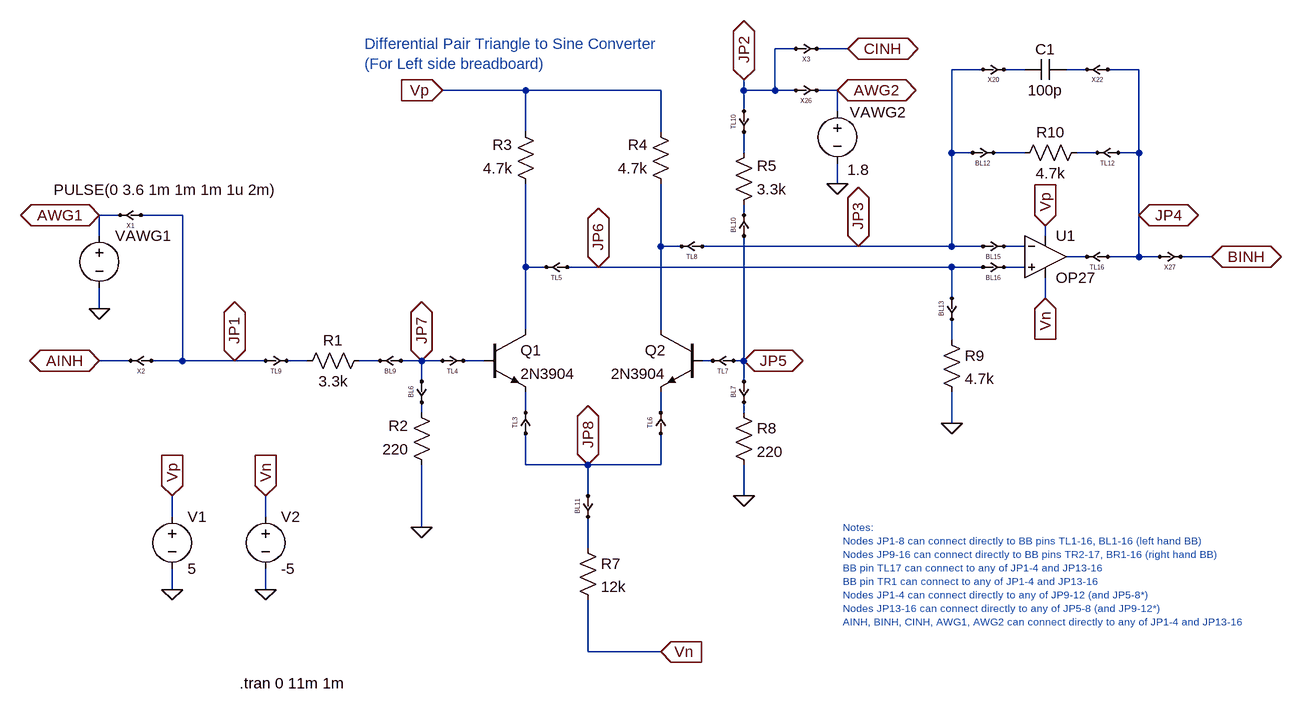
[diagram p0: schematic diffpair_triangle_to_sine.asc]
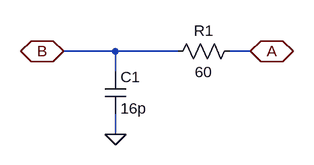
[diagram p1: sub-circuit cross_point.asc]
diffpair_triangle_to_sine.asc, the LTspice schematic file:
Version 4
SHEET 1 880 960
WIRE -16 -144 -48 -144
WIRE 64 -144 16 -144
WIRE 272 -112 224 -112
WIRE 336 -112 304 -112
WIRE 432 -112 400 -112
WIRE 512 -112 464 -112
WIRE -432 -80 -560 -80
WIRE -224 -80 -432 -80
WIRE -96 -80 -96 -96
WIRE -48 -80 -48 -144
WIRE -48 -80 -96 -80
WIRE -16 -80 -48 -80
WIRE 48 -80 16 -80
WIRE -96 -48 -96 -80
WIRE 48 -48 48 -80
WIRE -432 -16 -432 -80
WIRE -224 -16 -224 -80
WIRE -96 16 -96 -16
WIRE 224 16 224 -112
WIRE 256 16 224 16
WIRE 336 16 288 16
WIRE 448 16 416 16
WIRE 512 16 512 -112
WIRE 512 16 480 16
WIRE 48 64 48 32
WIRE -1056 112 -1088 112
WIRE -960 112 -1024 112
WIRE -96 112 -96 96
WIRE 512 112 512 16
WIRE -1088 144 -1088 112
WIRE 368 144 368 128
WIRE -224 160 -224 64
WIRE -192 160 -224 160
WIRE 80 160 -160 160
WIRE 224 160 224 16
WIRE 224 160 80 160
WIRE 272 160 224 160
WIRE 336 160 304 160
WIRE 432 176 400 176
WIRE 512 176 512 112
WIRE 512 176 464 176
WIRE 544 176 512 176
WIRE 624 176 576 176
WIRE -432 192 -432 64
WIRE -400 192 -432 192
WIRE -320 192 -368 192
WIRE 224 192 -320 192
WIRE 272 192 224 192
WIRE 336 192 304 192
WIRE 224 240 224 192
WIRE 368 240 368 208
WIRE -1088 256 -1088 224
WIRE -432 288 -432 192
WIRE -224 288 -224 160
WIRE 224 304 224 272
WIRE -1040 336 -1088 336
WIRE -960 336 -960 112
WIRE -960 336 -1008 336
WIRE -880 336 -960 336
WIRE -832 336 -880 336
WIRE -768 336 -800 336
WIRE -656 336 -688 336
WIRE -592 336 -624 336
WIRE -560 336 -592 336
WIRE -496 336 -528 336
WIRE -144 336 -160 336
WIRE -96 336 -96 144
WIRE -96 336 -112 336
WIRE -592 368 -592 336
WIRE -96 368 -96 336
WIRE -592 416 -592 400
WIRE -432 416 -432 384
WIRE -224 416 -224 384
WIRE -96 416 -96 400
WIRE 224 432 224 384
WIRE -432 496 -432 448
WIRE -336 496 -432 496
WIRE -224 496 -224 448
WIRE -224 496 -336 496
WIRE -336 544 -336 496
WIRE -96 544 -96 496
WIRE -976 576 -976 544
WIRE -832 576 -832 544
WIRE -592 592 -592 496
WIRE -336 624 -336 576
WIRE -976 688 -976 656
WIRE -832 688 -832 656
WIRE -336 784 -336 704
WIRE -224 784 -336 784
FLAG -96 544 0
FLAG 224 432 0
FLAG 368 128 Vp
IOPIN 368 128 In
FLAG 368 240 Vn
IOPIN 368 240 In
FLAG -560 -80 Vp
IOPIN -560 -80 In
FLAG -224 784 Vn
IOPIN -224 784 In
FLAG -592 592 0
FLAG -976 688 0
FLAG -832 688 0
FLAG -976 544 Vp
IOPIN -976 544 In
FLAG -832 544 Vn
IOPIN -832 544 In
FLAG -880 336 JP1
IOPIN -880 336 BiDir
FLAG -1088 112 AWG1
IOPIN -1088 112 BiDir
FLAG -1088 336 AINH
IOPIN -1088 336 BiDir
FLAG -1088 256 0
FLAG -96 -96 JP2
IOPIN -96 -96 BiDir
FLAG 48 -80 AWG2
IOPIN 48 -80 BiDir
FLAG 48 64 0
FLAG -592 336 JP7
IOPIN -592 336 BiDir
FLAG -336 496 JP8
IOPIN -336 496 BiDir
FLAG -320 192 JP6
IOPIN -320 192 BiDir
FLAG 80 160 JP3
IOPIN 80 160 BiDir
FLAG -96 336 JP5
IOPIN -96 336 BiDir
FLAG 624 176 BINH
IOPIN 624 176 BiDir
FLAG 512 112 JP4
IOPIN 512 112 BiDir
FLAG 64 -144 CINH
IOPIN 64 -144 BiDir
SYMBOL Opamps\\OP27 368 112 R0
SYMATTR InstName U1
SYMBOL npn -496 288 R0
SYMATTR InstName Q1
SYMATTR Value 2N3904
SYMBOL npn -160 288 M0
SYMATTR InstName Q2
SYMATTR Value 2N3904
SYMBOL res -672 320 R90
WINDOW 0 0 56 VBottom 2
WINDOW 3 32 56 VTop 2
SYMATTR InstName R1
SYMATTR Value 3.3k
SYMBOL res -576 512 R180
WINDOW 0 36 76 Left 2
WINDOW 3 36 40 Left 2
SYMATTR InstName R2
SYMATTR Value 220
SYMBOL res -416 80 R180
WINDOW 0 36 76 Left 2
WINDOW 3 36 40 Left 2
SYMATTR InstName R3
SYMATTR Value 4.7k
SYMBOL res -208 80 R180
WINDOW 0 36 76 Left 2
WINDOW 3 36 40 Left 2
SYMATTR InstName R4
SYMATTR Value 4.7k
SYMBOL res -352 608 R0
SYMATTR InstName R7
SYMATTR Value 12k
SYMBOL res -112 400 R0
SYMATTR InstName R8
SYMATTR Value 220
SYMBOL res 208 288 R0
SYMATTR InstName R9
SYMATTR Value 4.7k
SYMBOL res 432 0 R90
WINDOW 0 0 56 VBottom 2
WINDOW 3 32 56 VTop 2
SYMATTR InstName R10
SYMATTR Value 4.7k
SYMBOL cap 400 -128 R90
WINDOW 0 0 32 VBottom 2
WINDOW 3 32 32 VTop 2
SYMATTR InstName C1
SYMATTR Value 100p
SYMBOL voltage -976 560 R0
WINDOW 123 0 0 Left 0
WINDOW 39 0 0 Left 0
SYMATTR InstName V1
SYMATTR Value 5
SYMBOL voltage -832 560 R0
WINDOW 123 0 0 Left 0
WINDOW 39 0 0 Left 0
SYMATTR InstName V2
SYMATTR Value -5
SYMBOL voltage -1088 128 R0
WINDOW 123 0 0 Left 0
WINDOW 39 0 0 Left 0
WINDOW 3 -70 -55 Left 2
SYMATTR Value PULSE(0 3.6 1m 1m 1m 1u 2m)
SYMATTR InstName VAWG1
SYMBOL cross_point -1040 112 M180
SYMATTR InstName X1
SYMBOL cross_point -1024 336 M180
SYMATTR InstName X2
SYMBOL cross_point -816 336 R180
SYMATTR InstName TL9
SYMBOL cross_point -640 336 M180
SYMATTR InstName BL9
SYMBOL cross_point -544 336 R180
SYMATTR InstName TL4
SYMBOL cross_point -592 384 R270
SYMATTR InstName BL6
SYMBOL cross_point -432 432 M90
SYMATTR InstName TL3
SYMBOL cross_point -224 432 M90
SYMATTR InstName TL6
SYMBOL cross_point -128 336 M180
SYMATTR InstName TL7
SYMBOL cross_point -336 560 R270
SYMATTR InstName BL11
SYMBOL cross_point -96 384 R270
SYMATTR InstName BL7
SYMBOL cross_point 224 256 R270
SYMATTR InstName BL13
SYMBOL cross_point -384 192 M180
SYMATTR InstName TL5
SYMBOL cross_point -176 160 M180
SYMATTR InstName TL8
SYMBOL cross_point 288 160 R180
SYMATTR InstName BL15
SYMBOL cross_point 288 192 R180
SYMATTR InstName BL16
SYMBOL cross_point 272 16 R180
SYMATTR InstName BL12
SYMBOL cross_point 288 -112 R180
SYMATTR InstName X20
SYMBOL cross_point 464 16 M180
SYMATTR InstName TL12
SYMBOL cross_point 448 -112 M180
SYMATTR InstName X22
SYMBOL cross_point 448 176 M180
SYMATTR InstName TL16
SYMBOL res -112 112 M180
WINDOW 0 36 76 Left 2
WINDOW 3 36 40 Left 2
SYMATTR InstName R5
SYMATTR Value 3.3k
SYMBOL cross_point -96 -32 R270
SYMATTR InstName TL10
SYMBOL cross_point -96 128 M90
SYMATTR InstName BL10
SYMBOL voltage 48 -64 M0
WINDOW 123 0 0 Left 0
WINDOW 39 0 0 Left 0
WINDOW 0 -105 18 Left 2
WINDOW 3 -49 106 Left 2
SYMATTR InstName VAWG2
SYMATTR Value 1.8
SYMBOL cross_point 0 -80 R180
SYMATTR InstName X26
SYMBOL cross_point 560 176 R180
SYMATTR InstName X27
SYMBOL cross_point 0 -144 R180
SYMATTR InstName X3
TEXT -872 832 Left 2 !.tran 0 11m 1m
TEXT -680 -152 Left 2 ;Differential Pair Triangle to Sine Converter\n(For Left side breadboard)
TEXT 56 592 Left 1 ;Notes:\nNodes JP1-8 can connect directly to BB pins TL1-16, BL1-16 (left hand BB)\nNodes JP9-16 can connect directly to BB pins TR2-17, BR1-16 (right hand BB)\nBB pin TL17 can connect to any of JP1-4 and JP13-16\nBB pin TR1 can connect to any of JP1-4 and JP13-16\nNodes JP1-4 can connect directly to any of JP9-12 (and JP5-8*)\nNodes JP13-16 can connect directly to any of JP5-8 (and JP9-12*)\nAINH, BINH, CINH, AWG1, AWG2 can connect directly to any of JP1-4 and JP13-16

cross_point.asc, the sub-circuit schematic file:
Version 4
SHEET 1 880 680
WIRE 80 160 0 160
WIRE 176 160 80 160
WIRE 288 160 256 160
WIRE 80 192 80 160
WIRE 80 288 80 256
FLAG 288 160 A
IOPIN 288 160 BiDir
FLAG 0 160 B
IOPIN 0 160 BiDir
FLAG 80 288 0
SYMBOL res 272 144 R90
WINDOW 0 0 56 VBottom 2
WINDOW 3 32 56 VTop 2
SYMATTR InstName R1
SYMATTR Value 60
SYMBOL cap 64 192 R0
SYMATTR InstName C1
SYMATTR Value 16p

The netlist it stands for:
* diffpair_triangle_to_sine.asc
XU1 N011 N008 Vp Vn N009 OP27  ; pins In+ In- V+ V- OUT
Q1 N010 N015 N018 0 2N3904
Q2 N007 N016 N019 0 2N3904
R1 N014 N013 3.3k
R2 0 N017 220
R3 N010 Vp 4.7k
R4 N007 Vp 4.7k
R7 N021 Vn 12k
R8 N020 0 220
R9 N012 0 4.7k
R10 N005 N004 4.7k
C1 N002 N001 100p
V1 Vp 0 5
V2 Vn 0 -5
VAWG1 AWG1 0 PULSE(0 3.6 1m 1m 1m 1u 2m)
XX1 JP1 AWG1 cross_point
XX2 JP1 AINH cross_point
XTL9 JP1 N013 cross_point
XBL9 JP7 N014 cross_point
XTL4 JP7 N015 cross_point
XBL6 JP7 N017 cross_point
XTL3 JP8 N018 cross_point
XTL6 JP8 N019 cross_point
XTL7 JP5 N016 cross_point
XBL11 JP8 N021 cross_point
XBL7 JP5 N020 cross_point
XBL13 JP6 N012 cross_point
XTL5 JP6 N010 cross_point
XTL8 JP3 N007 cross_point
XBL15 JP3 N008 cross_point
XBL16 JP6 N011 cross_point
XBL12 JP3 N004 cross_point
XX20 JP3 N001 cross_point
XTL12 JP4 N005 cross_point
XX22 JP4 N002 cross_point
XTL16 JP4 N009 cross_point
R5 N006 N003 3.3k
XTL10 JP2 N003 cross_point
XBL10 JP5 N006 cross_point
VAWG2 AWG2 0 1.8
XX26 JP2 AWG2 cross_point
XX27 JP4 BINH cross_point
XX3 JP2 CINH cross_point

* block symbol definitions
.subckt cross_point A B
R1 A B 60
C1 B 0 16p
.ends cross_point

.model NPN NPN
.model PNP PNP
.lib standard.bjt
.tran 0 11m 1m
* Differential Pair Triangle to Sine Converter
* (For Left side breadboard)
* Notes:
* Nodes JP1-8 can connect directly to BB pins TL1-16, BL1-16 (left hand BB)
* Nodes JP9-16 can connect directly to BB pins TR2-17, BR1-16 (right hand BB)
* BB pin TL17 can connect to any of JP1-4 and JP13-16
* BB pin TR1 can connect to any of JP1-4 and JP13-16
* Nodes JP1-4 can connect directly to any of JP9-12 (and JP5-8*)
* Nodes JP13-16 can connect directly to any of JP5-8 (and JP9-12*)
* AINH, BINH, CINH, AWG1, AWG2 can connect directly to any of JP1-4 and JP13-16
.lib ADI.lib
.backanno
.end